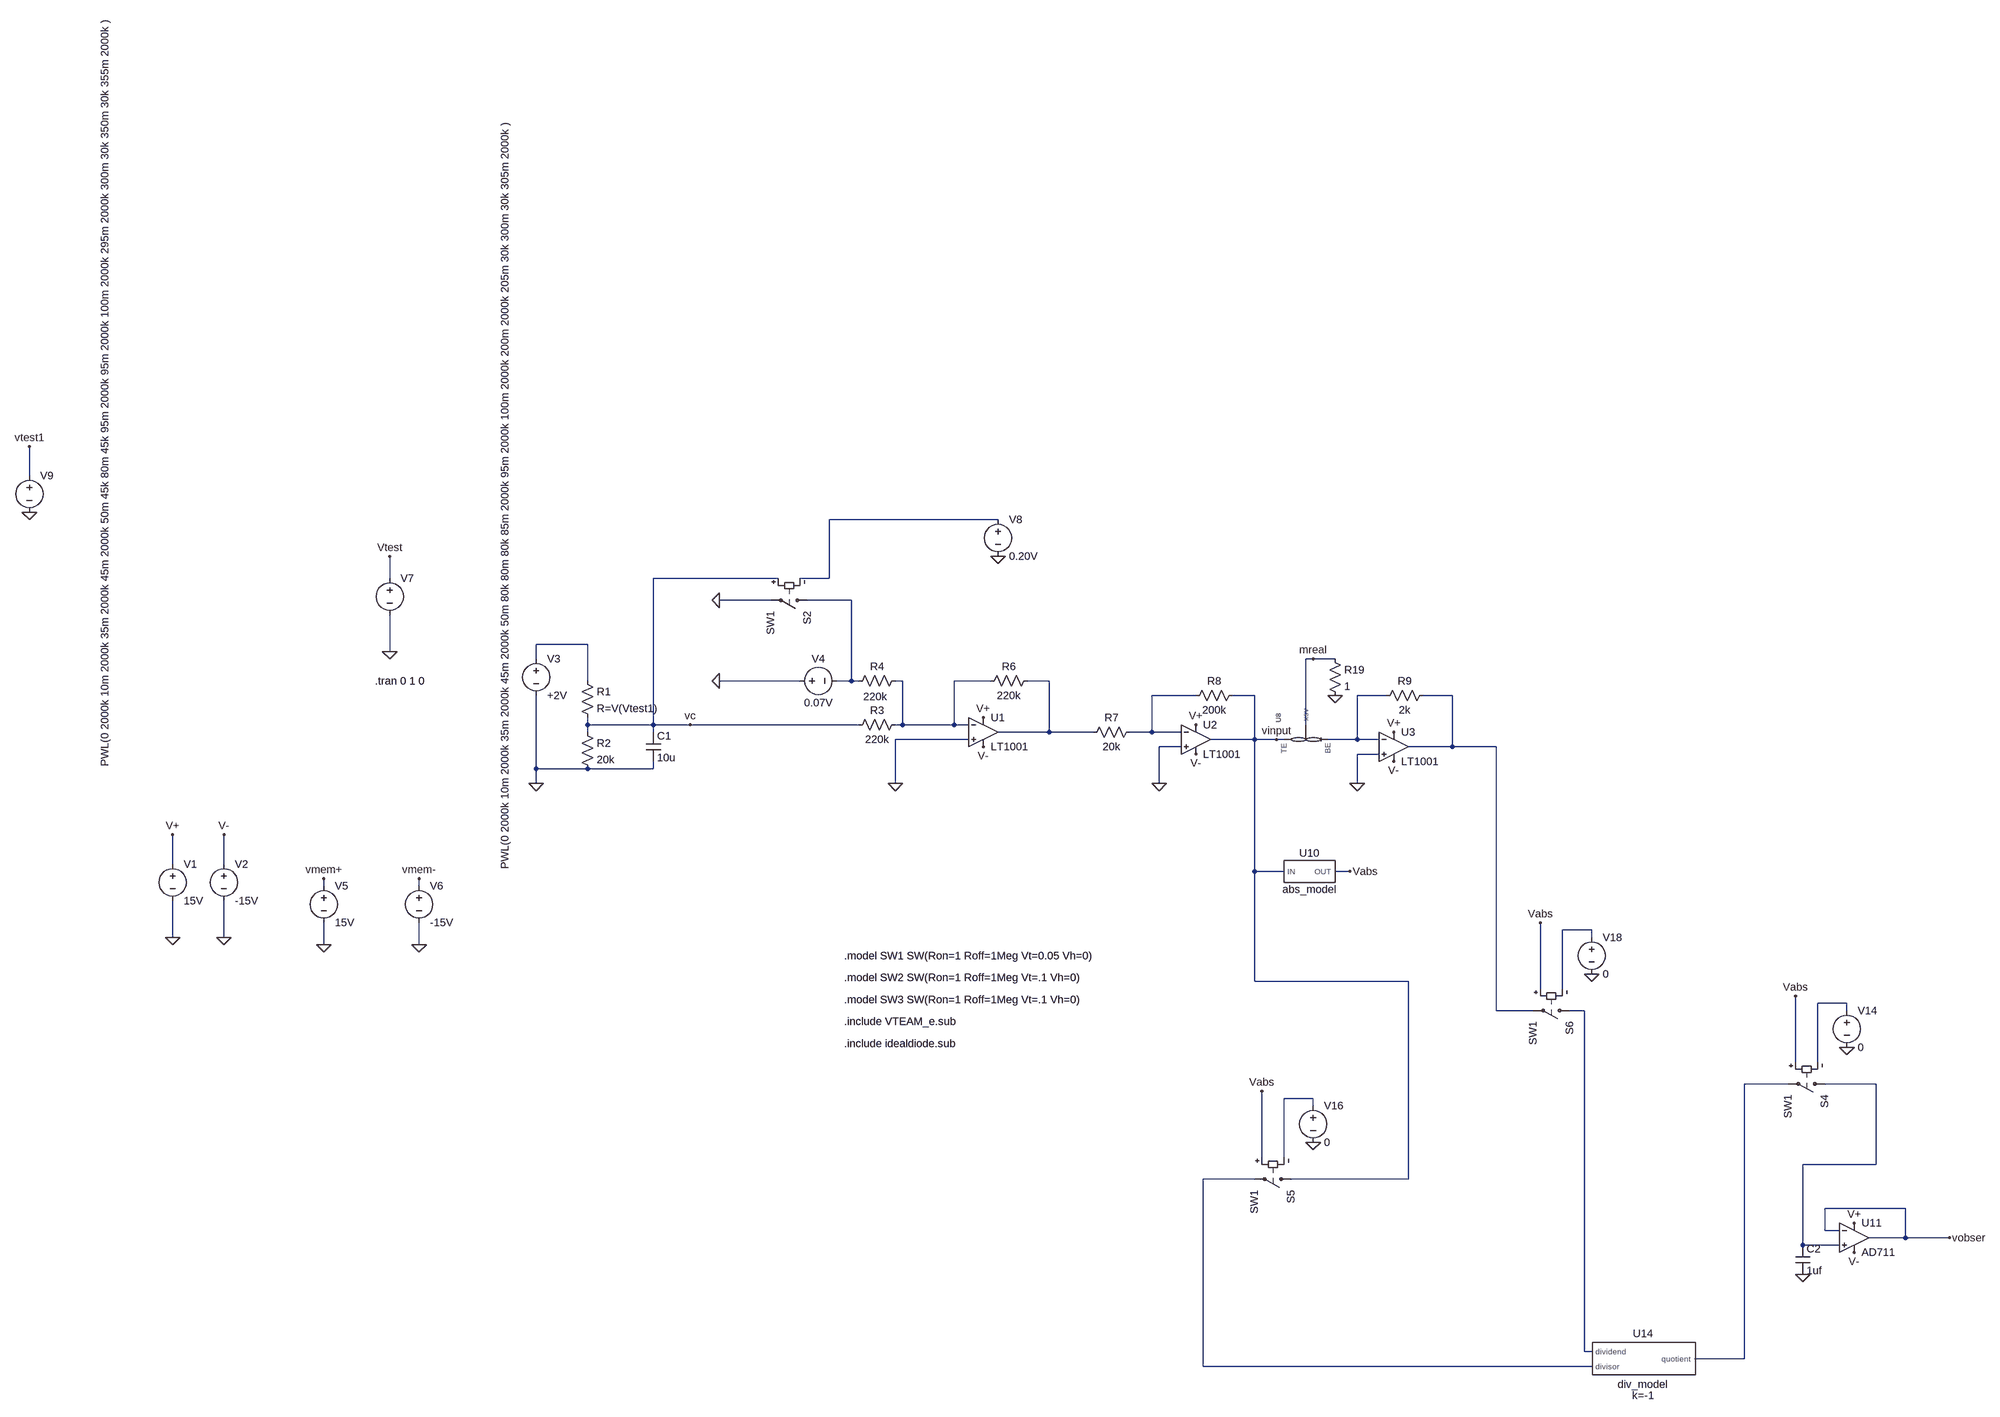
[diagram p0: schematic mem_nociceptor.asc]
mem_nociceptor.asc, the LTspice schematic file:
Version 4
SHEET 1 2792 1472
WIRE -3328 -816 -3328 -880
WIRE -832 -720 -1200 -720
WIRE -2208 -592 -2208 -640
WIRE -1312 -592 -1584 -592
WIRE -1200 -592 -1200 -720
WIRE -1200 -592 -1264 -592
WIRE -1328 -544 -1440 -544
WIRE -1152 -544 -1248 -544
WIRE -1728 -448 -1840 -448
WIRE -2208 -432 -2208 -512
WIRE -1840 -416 -1840 -448
WIRE -144 -416 -160 -416
WIRE -96 -416 -144 -416
WIRE -1728 -368 -1728 -448
WIRE -1264 -368 -1440 -368
WIRE -1152 -368 -1152 -544
WIRE -1152 -368 -1184 -368
WIRE -1136 -368 -1152 -368
WIRE -1040 -368 -1056 -368
WIRE -848 -368 -928 -368
WIRE -720 -368 -768 -368
WIRE -400 -336 -496 -336
WIRE -272 -336 -320 -336
WIRE 16 -336 -48 -336
WIRE 160 -336 96 -336
WIRE -1728 -272 -1728 -288
WIRE -1584 -272 -1584 -592
WIRE -1584 -272 -1728 -272
WIRE -1504 -272 -1584 -272
WIRE -1136 -272 -1504 -272
WIRE -1040 -272 -1040 -368
WIRE -1040 -272 -1056 -272
WIRE -928 -272 -928 -368
WIRE -928 -272 -1040 -272
WIRE -896 -272 -928 -272
WIRE -160 -272 -160 -416
WIRE -1728 -256 -1728 -272
WIRE -1584 -256 -1584 -272
WIRE -720 -256 -720 -368
WIRE -720 -256 -832 -256
WIRE -624 -256 -720 -256
WIRE -496 -256 -496 -336
WIRE -496 -256 -544 -256
WIRE -432 -256 -496 -256
WIRE -896 -240 -1056 -240
WIRE -272 -240 -272 -336
WIRE -272 -240 -368 -240
WIRE -224 -240 -272 -240
WIRE -208 -240 -224 -240
WIRE -48 -240 -48 -336
WIRE -48 -240 -112 -240
WIRE 0 -240 -48 -240
WIRE -432 -224 -480 -224
WIRE 160 -224 160 -336
WIRE 160 -224 64 -224
WIRE 256 -224 160 -224
WIRE 0 -208 -48 -208
WIRE -1840 -176 -1840 -336
WIRE -1728 -176 -1840 -176
WIRE -1584 -176 -1584 -192
WIRE -1584 -176 -1728 -176
WIRE -1840 -144 -1840 -176
WIRE -1056 -144 -1056 -240
WIRE -480 -144 -480 -224
WIRE -48 -144 -48 -208
WIRE -2832 32 -2832 -32
WIRE -2720 32 -2720 -32
WIRE -272 48 -272 -240
WIRE -208 48 -272 48
WIRE -64 48 -96 48
WIRE -2352 80 -2352 64
WIRE -2144 80 -2144 64
WIRE 464 176 400 176
WIRE -2832 192 -2832 112
WIRE -2720 192 -2720 112
WIRE 464 192 464 176
WIRE -2352 208 -2352 160
WIRE -2144 208 -2144 160
WIRE -272 288 -272 48
WIRE 64 288 -272 288
WIRE 352 304 352 160
WIRE 400 304 400 176
WIRE 1216 336 1152 336
WIRE 256 352 256 -224
WIRE 336 352 256 352
WIRE 448 352 416 352
WIRE 1216 352 1216 336
WIRE 1104 464 1104 320
WIRE 1152 464 1152 336
WIRE 1088 512 992 512
WIRE 1280 512 1168 512
WIRE -144 544 -208 544
WIRE -144 560 -144 544
WIRE -256 672 -256 528
WIRE -208 672 -208 544
WIRE 1280 688 1280 512
WIRE 1280 688 1120 688
WIRE -272 720 -384 720
WIRE 64 720 64 288
WIRE 64 720 -192 720
WIRE 1344 784 1168 784
WIRE 1168 832 1168 784
WIRE 1200 832 1168 832
WIRE 1344 848 1344 784
WIRE 1344 848 1264 848
WIRE 1440 848 1344 848
WIRE 1120 864 1120 688
WIRE 1200 864 1120 864
WIRE 448 1120 448 352
WIRE 464 1120 448 1120
WIRE 992 1136 992 512
WIRE 992 1136 688 1136
WIRE -384 1152 -384 720
WIRE 464 1152 -384 1152
FLAG -2720 192 0
FLAG -2832 192 0
FLAG -2832 -32 V+
FLAG -2720 -32 V-
FLAG -1840 -144 0
FLAG -864 -288 V+
FLAG -864 -224 V-
FLAG -400 -272 V+
FLAG -400 -208 V-
FLAG -1056 -144 0
FLAG -480 -144 0
FLAG 32 -256 V+
FLAG 32 -192 V-
FLAG -48 -144 0
FLAG -1440 -368 0
FLAG -2352 208 0
FLAG -2352 64 vmem+
FLAG -2144 208 0
FLAG -2144 64 vmem-
FLAG -1440 -544 0
FLAG -2208 -432 0
FLAG -2208 -640 Vtest
FLAG 1216 432 0
FLAG 1120 928 0
FLAG 1232 816 V+
FLAG 1232 880 V-
FLAG -144 640 0
FLAG 464 272 0
FLAG -64 48 Vabs
FLAG -256 528 Vabs
FLAG 352 160 Vabs
FLAG 1104 320 Vabs
FLAG -96 -336 0
FLAG -832 -640 0
FLAG -224 -240 vinput
FLAG -144 -416 mreal
FLAG 1440 848 vobser
FLAG -1504 -272 vc
FLAG -3328 -736 0
FLAG -3328 -880 vtest1
SYMBOL voltage -2832 16 R0
SYMATTR InstName V1
SYMATTR Value 15V
SYMBOL voltage -2720 16 R0
WINDOW 123 0 0 Left 0
WINDOW 39 0 0 Left 0
SYMATTR InstName V2
SYMATTR Value -15V
SYMBOL voltage -1840 -432 R0
WINDOW 123 0 0 Left 0
WINDOW 39 0 0 Left 0
SYMATTR InstName V3
SYMATTR Value +2V
SYMBOL res -1744 -384 R0
SYMATTR InstName R1
SYMATTR Value R=V(Vtest1)
SYMBOL res -1744 -272 R0
SYMATTR InstName R2
SYMATTR Value 20k
SYMBOL cap -1600 -256 R0
SYMATTR InstName C1
SYMATTR Value 10u
SYMBOL OpAmps\\LT1001 -864 -320 R0
SYMATTR InstName U1
SYMBOL OpAmps\\LT1001 -400 -304 R0
SYMATTR InstName U2
SYMBOL res -1040 -288 R90
WINDOW 0 0 56 VBottom 2
WINDOW 3 32 56 VTop 2
SYMATTR InstName R3
SYMATTR Value 220k
SYMBOL res -1040 -384 R90
WINDOW 0 0 56 VBottom 2
WINDOW 3 35 60 VTop 2
SYMATTR InstName R4
SYMATTR Value 220k
SYMBOL res -752 -384 R90
WINDOW 0 0 56 VBottom 2
WINDOW 3 32 56 VTop 2
SYMATTR InstName R6
SYMATTR Value 220k
SYMBOL res -528 -272 R90
WINDOW 0 0 56 VBottom 2
WINDOW 3 32 56 VTop 2
SYMATTR InstName R7
SYMATTR Value 20k
SYMBOL res -304 -352 R90
WINDOW 0 0 56 VBottom 2
WINDOW 3 32 56 VTop 2
SYMATTR InstName R8
SYMATTR Value 200k
SYMBOL OpAmps\\LT1001 32 -288 R0
SYMATTR InstName U3
SYMBOL res 112 -352 R90
WINDOW 0 0 56 VBottom 2
WINDOW 3 32 56 VTop 2
SYMATTR InstName R9
SYMATTR Value 2k
SYMBOL voltage -1280 -368 R270
WINDOW 0 32 56 VTop 2
WINDOW 3 -32 56 VBottom 2
WINDOW 123 0 0 Left 0
WINDOW 39 0 0 Left 0
SYMATTR InstName V4
SYMATTR Value 0.07V
SYMBOL sw -1232 -544 R90
SYMATTR InstName S2
SYMATTR Value SW1
SYMBOL voltage -2352 64 R0
SYMATTR InstName V5
SYMATTR Value 15V
SYMBOL voltage -2144 64 R0
SYMATTR InstName V6
SYMATTR Value -15V
SYMBOL voltage -2208 -608 R0
WINDOW 123 0 0 Left 0
WINDOW 39 0 0 Left 0
WINDOW 3 300 651 VLeft 2
SYMATTR Value PWL(0 2000k 10m 2000k 35m 2000k 45m 2000k 50m 80k 80m 80k 85m 2000k 95m 2000k 100m 2000k 200m 2000k 205m 30k 300m 30k 305m 2000k )
SYMATTR InstName V7
SYMBOL cap 1104 864 R0
SYMATTR InstName C2
SYMATTR Value 1uf
SYMBOL OpAmps\\AD711 1232 784 R0
SYMATTR InstName U11
SYMBOL sw 1184 512 R90
SYMATTR InstName S4
SYMATTR Value SW1
SYMBOL voltage 1216 336 R0
WINDOW 123 0 0 Left 0
WINDOW 39 0 0 Left 0
SYMATTR InstName V14
SYMATTR Value 0
SYMBOL sw -176 720 R90
SYMATTR InstName S5
SYMATTR Value SW1
SYMBOL voltage -144 544 R0
WINDOW 123 0 0 Left 0
WINDOW 39 0 0 Left 0
SYMATTR InstName V16
SYMATTR Value 0
SYMBOL sw 432 352 R90
SYMATTR InstName S6
SYMATTR Value SW1
SYMBOL voltage 464 176 R0
WINDOW 123 0 0 Left 0
WINDOW 39 0 0 Left 0
SYMATTR InstName V18
SYMATTR Value 0
SYMBOL AutoGenerated\\div_model 576 1136 R0
SYMATTR InstName U14
SYMATTR SpiceLine k=-1
SYMBOL AutoGenerated\\abs_model -160 48 R0
SYMATTR InstName U10
SYMBOL memristor_with_state -160 -240 R270
SYMATTR InstName U8
SYMATTR Value VTEAM_e
SYMBOL res -112 -432 R0
SYMATTR InstName R19
SYMATTR Value 1
SYMBOL voltage -832 -736 R0
WINDOW 123 0 0 Left 0
WINDOW 39 0 0 Left 0
SYMATTR InstName V8
SYMATTR Value 0.20V
SYMBOL voltage -3328 -832 R0
WINDOW 123 0 0 Left 0
WINDOW 39 0 0 Left 0
WINDOW 3 300 651 VLeft 2
SYMATTR Value PWL(0 2000k 10m 2000k 35m 2000k 45m 2000k 50m 45k 80m 45k 95m 2000k 95m 2000k 100m 2000k 295m 2000k 300m 30k 350m 30k 355m 2000k )
SYMATTR InstName V9
TEXT -2240 -368 Left 2 !.tran 0 1 0
TEXT -1168 232 Left 2 !.model SW1 SW(Ron=1 Roff=1Meg Vt=0.05 Vh=0)
TEXT -1168 280 Left 2 !.model SW2 SW(Ron=1 Roff=1Meg Vt=.1 Vh=0)
TEXT -1168 328 Left 2 !.model SW3 SW(Ron=1 Roff=1Meg Vt=.1 Vh=0)
TEXT -1168 376 Left 2 !.include VTEAM_e.sub
TEXT -1168 424 Left 2 !.include idealdiode.sub

The netlist it stands for:
* mem_nociceptor.asc
V1 V+ 0 15V
V2 V- 0 -15V
V3 N003 0 +2V
R1 N003 vc R=V(Vtest1)
R2 vc 0 20k
C1 vc 0 10u
XU1 0 N004 V+ V- N005 LT1001  ; pins In+ In- V+ V- OUT
XU2 0 N006 V+ V- vinput LT1001  ; pins In+ In- V+ V- OUT
R3 N004 vc 220k
R4 N004 N002 220k
R6 N005 N004 220k
R7 N006 N005 20k
R8 vinput N006 200k
XU3 0 N007 V+ V- N008 LT1001  ; pins In+ In- V+ V- OUT
R9 N008 N007 2k
V4 0 N002 0.07V
S2 N002 0 vc N001 SW1
V5 vmem+ 0 15V
V6 vmem- 0 -15V
V7 Vtest 0 PWL(0 2000k 10m 2000k 35m 2000k 45m 2000k 50m 80k 80m 80k 85m 2000k 95m 2000k 100m 2000k 200m 2000k 205m 30k 300m 30k 305m 2000k )
C2 N013 0 1uf
XU11 N013 vobser V+ V- vobser AD712  ; AD711, pins In+ In- V+ V- OUT
S4 N013 N012 Vabs N010 SW1
V14 N010 0 0
S5 vinput N015 Vabs N014 SW1
V16 N014 0 0
S6 N011 N008 Vabs N009 SW1
V18 N009 0 0
XU14 N011 N015 N012 div_model k=-1  ; pins dividend divisor quotient
XU10 vinput Vabs abs_model  ; pins IN OUT
XU8 vinput N007 mreal VTEAM_e  ; pins TE BE xsv
R19 mreal 0 1
V8 N001 0 0.20V
V9 vtest1 0 PWL(0 2000k 10m 2000k 35m 2000k 45m 2000k 50m 45k 80m 45k 95m 2000k 95m 2000k 100m 2000k 295m 2000k 300m 30k 350m 30k 355m 2000k )
.tran 0 1 0
.model SW1 SW(Ron=1 Roff=1Meg Vt=0.05 Vh=0)
.model SW2 SW(Ron=1 Roff=1Meg Vt=.1 Vh=0)
.model SW3 SW(Ron=1 Roff=1Meg Vt=.1 Vh=0)
.include VTEAM_e.sub
.include idealdiode.sub
.lib LTC.lib
.lib ADI1.lib
.lib C:\Users\ASUS\Desktop\Memristor_model\division_model\div_model.sub
.lib C:\Users\ASUS\Desktop\Memristor_model\abs_model\abs_model.sub
.backanno
.end